# EAGLE schematic untitled (EAGLE 7.5.0)
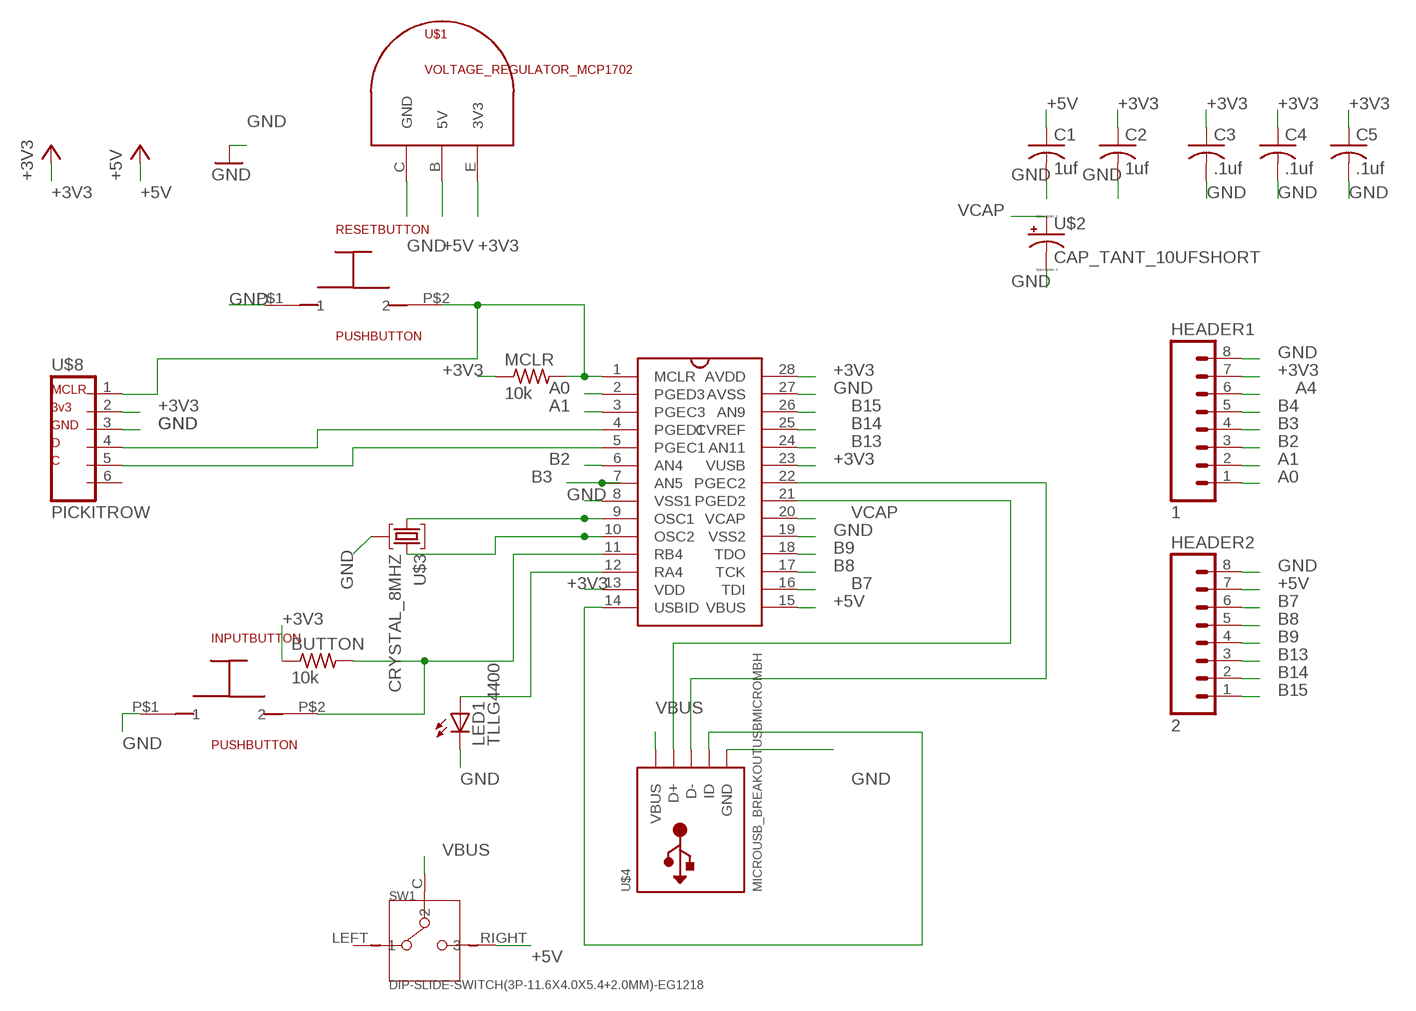
[diagram p0: schematic, sheet 1]

## Parts
BUTTON  10k  R-US_0207/10  [0207/10]
C1  1uf  C-US025-030X050  [C025-030X050]
C2  1uf  C-US025-030X050  [C025-030X050]
C3  .1uf  C-US050-030X075  [C050-030X075]
C4  .1uf  C-US025-030X050  [C025-030X050]
C5  .1uf  C-US025-030X050  [C025-030X050]
HEADER1  1  M08  [1X08_ROUND]
HEADER2  2  M08  [1X08_ROUND]
INPUTBUTTON  PUSHBUTTON  [PUSHBUTTON]
LED1  TLLG4400  [LED3MM]
MCLR  10k  R-US_0207/10  [0207/10]
RESETBUTTON  PUSHBUTTON  [PUSHBUTTON]
SW1  DIP-SLIDE-SWITCH(3P-11.6X4.0X5.4+2.0MM)-EG1218  [SW3-2.5-11.6X4.0X5.4+2.0MM]
U$1  VOLTAGE_REGULATOR_MCP1702  [TO92-EBC]
U$2  CAP_TANT_10UFSHORT  [C025-040X050POL]
U$3  CRYSTAL_8MHZ  [CRYSTAL_8MHZ]
U$4  MICROUSB_BREAKOUTUSBMICROMBH  [USB-MB-H]
U$5  PIC32MX250F128B  [DIL28-3]
U$8  PICKITROW  [1X06_LOCK]

## Nets
+3V3: BUTTON.1 C2.1 C3.1 C4.1 C5.1 HEADER1.7 MCLR.1 U$1.E(3V3) U$5.13(VDD) U$5.23(VUSB) U$5.28(AVDD) U$8.2(3V3)
+5V: C1.1 HEADER2.7 SW1.RIGHT U$1.B(5V) U$5.15(VBUS)
A0: HEADER1.1 U$5.2(PGED3)
A1: HEADER1.2 U$5.3(PGEC3)
A4: HEADER1.6 LED1.A U$5.12(RA4)
B2: HEADER1.3 U$5.6(AN4)
B3: HEADER1.4 U$5.7(AN5)
B4: BUTTON.2 HEADER1.5 INPUTBUTTON.P$2 U$5.11(RB4)
B7: HEADER2.6 U$5.16(TDI)
B8: HEADER2.5 U$5.17(TCK)
B9: HEADER2.4 U$5.18(TDO)
B13: HEADER2.3 U$5.24(AN11)
B14: HEADER2.2 U$5.25(CVREF)
B15: HEADER2.1 U$5.26(AN9)
GND: C1.2 C2.2 C3.2 C4.2 C5.2 HEADER1.8 HEADER2.8 INPUTBUTTON.P$1 LED1.K(C) RESETBUTTON.P$1 U$1.C(GND) U$2.- U$3.GND U$4.GND U$5.8(VSS1) U$5.19(VSS2) U$5.27(AVSS) U$8.3(GND)
MCLR: MCLR.2 RESETBUTTON.P$2 U$5.1(MCLR) U$8.1(MCLR)
OSC1: U$3.OSC1 U$5.9(OSC1)
OSC2: U$3.OSC2 U$5.10(OSC2)
PICKITC: U$5.5(PGEC1) U$8.5(C)
PICKITD: U$5.4(PGED1) U$8.4(D)
USBD+: U$4.D+ U$5.21(PGED2)
USBD-: U$4.D- U$5.22(PGEC2)
USBID: U$4.ID U$5.14(USBID)
VBUS: SW1.C U$4.VBUS
VCAP: U$2.+ U$5.20(VCAP)
Unconnected: SW1.LEFT U$8.6

## Library data of the parts
BUTTON MCLR = components:R-US_: RESISTOR, American symbol
C1-C5 = components:C-US: CAPACITOR, American symbol
HEADER1 HEADER2 = components:M08: Header 8 Standard 8-pin 0.1" header. Use with straight break away headers (SKU : PRT-00116), right angle break away headers (PRT-00553), swiss pins (PRT-00743), machine pins (PRT-00117), and female headers (PRT-00115).; PROD_ID: CONN-08437
INPUTBUTTON RESETBUTTON = components:PUSHBUTTON
LED1 = components:TLLG4400: Low Current (2mA) LED 3 mm Tinted Diffused Package color GREEN Source: Data sheet <http://www.farnell.com/datasheets/391098.pdf>; MF: VISHAY SEMICONDUCTOR; OC_FARNELL: 1612435
SW1 = components:DIP-SLIDE-SWITCH(3P-11.6X4.0X5.4+2.0MM): 311010006
U$1 = components:VOLTAGE_REGULATOR_MCP1702
U$2 = components:CAP_TANT_10UF
U$3 = components:CRYSTAL_8MHZ
U$4 = components:MICROUSB_BREAKOUT
U$5 = components:PIC32MX250F128B
U$8 = components:PICKITROW